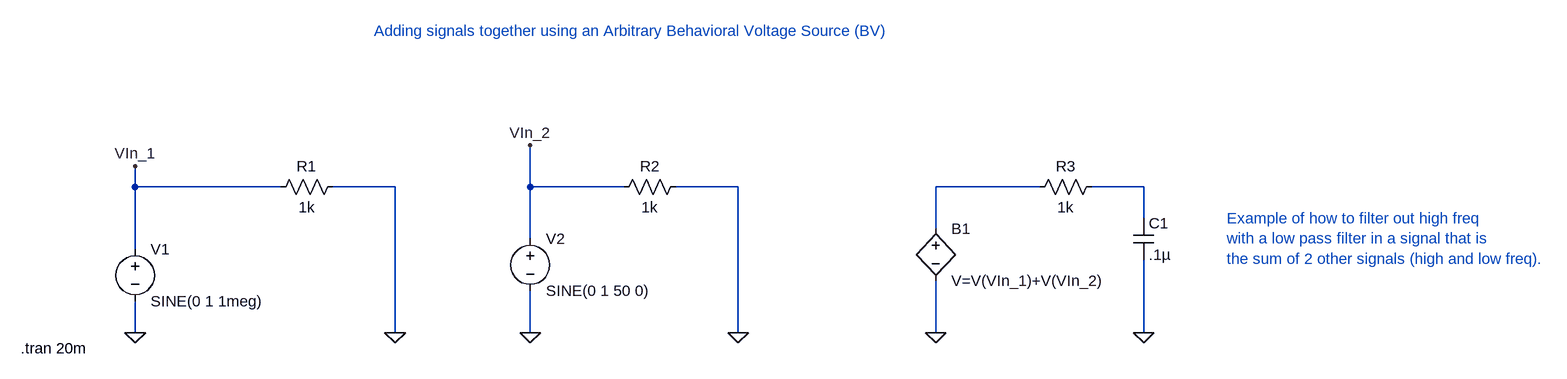
[diagram p0: schematic BehavioralVoltageSource.asc]
BehavioralVoltageSource.asc, the LTspice schematic file:
Version 4
SHEET 1 2448 680
WIRE 224 32 224 0
WIRE 448 32 224 32
WIRE 624 32 528 32
WIRE 832 32 832 -32
WIRE 976 32 832 32
WIRE 1152 32 1056 32
WIRE 1616 32 1456 32
WIRE 1776 32 1696 32
WIRE 1776 80 1776 32
WIRE 1456 96 1456 32
WIRE 832 112 832 32
WIRE 224 128 224 32
WIRE 224 256 224 208
WIRE 624 256 624 32
WIRE 832 256 832 192
WIRE 1152 256 1152 32
WIRE 1456 256 1456 176
WIRE 1776 256 1776 144
FLAG 224 256 0
FLAG 624 256 0
FLAG 832 256 0
FLAG 1152 256 0
FLAG 1456 256 0
FLAG 1776 256 0
FLAG 224 0 VIn_1
FLAG 832 -32 VIn_2
SYMBOL voltage 224 112 R0
WINDOW 123 0 0 Left 0
WINDOW 39 0 0 Left 0
SYMATTR InstName V1
SYMATTR Value SINE(0 1 1meg)
SYMBOL res 544 16 R90
WINDOW 0 0 56 VBottom 2
WINDOW 3 32 56 VTop 2
SYMATTR InstName R1
SYMATTR Value 1k
SYMBOL voltage 832 96 R0
WINDOW 123 0 0 Left 0
WINDOW 39 24 124 Left 2
SYMATTR InstName V2
SYMATTR Value SINE(0 1 50 0)
SYMBOL res 1072 16 R90
WINDOW 0 0 56 VBottom 2
WINDOW 3 32 56 VTop 2
SYMATTR InstName R2
SYMATTR Value 1k
SYMBOL bv 1456 80 R0
SYMATTR InstName B1
SYMATTR Value V=V(VIn_1)+V(VIn_2)
SYMBOL res 1712 16 R90
WINDOW 0 0 56 VBottom 2
WINDOW 3 32 56 VTop 2
SYMATTR InstName R3
SYMATTR Value 1k
SYMBOL cap 1760 80 R0
SYMATTR InstName C1
SYMATTR Value .1µ
TEXT 48 280 Left 2 !.tran 20m
TEXT 592 -208 Left 2 ;Adding signals together using an Arbitrary Behavioral Voltage Source (BV)
TEXT 1904 80 Left 2 ;Example of how to filter out high freq\nwith a low pass filter in a signal that is\nthe sum of 2 other signals (high and low freq).

The netlist it stands for:
* BehavioralVoltageSource.asc
V1 VIn_1 0 SINE(0 1 1meg)
R1 0 VIn_1 1k
V2 VIn_2 0 SINE(0 1 50 0)
R2 0 VIn_2 1k
B1 N001 0 V=V(VIn_1)+V(VIn_2)
R3 N002 N001 1k
C1 N002 0 .1µ
.tran 20m
* Adding signals together using an Arbitrary Behavioral Voltage Source (BV)
* Example of how to filter out high freq
* with a low pass filter in a signal that is
* the sum of 2 other signals (high and low freq).
.backanno
.end